# EAGLE schematic omnetics-adapter-64 (EAGLE 8.3.2)
DESIGNER: Jonathan Newman; DESIGN_NAME: 64 Channel Hirose to Omnetics Adapter; LICENSE: See README; REVISION: B
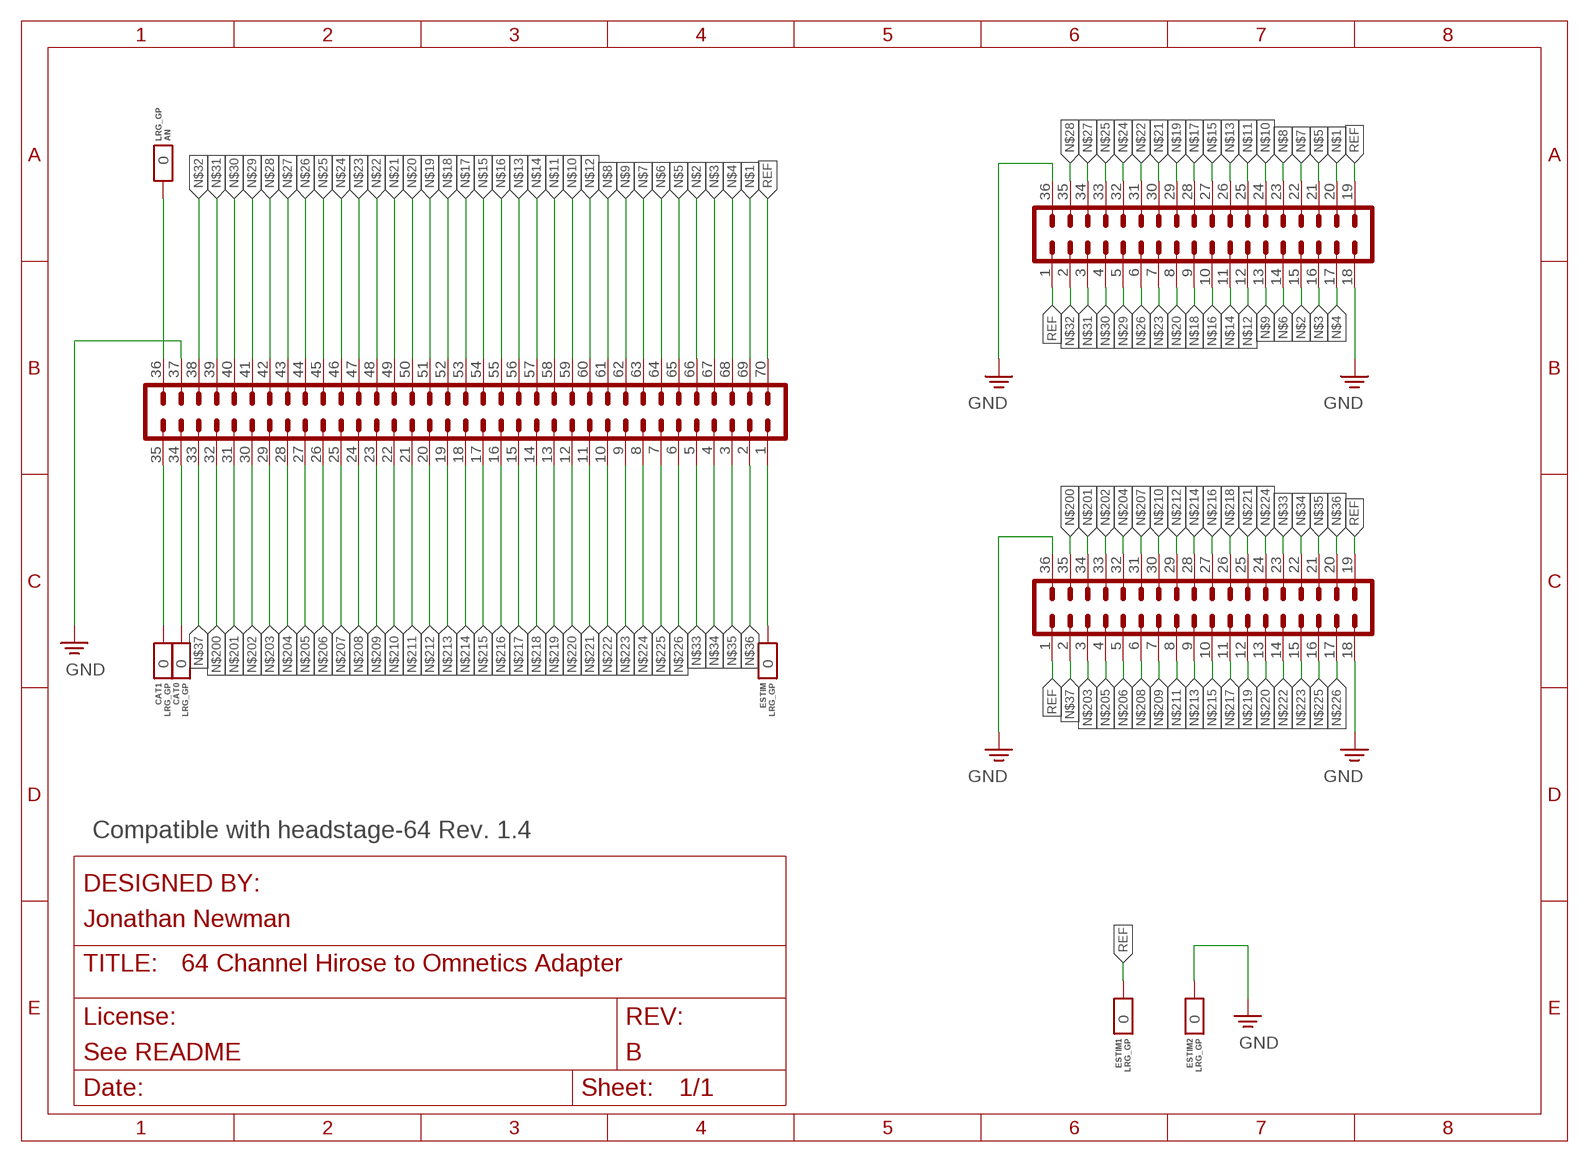
[diagram p0: schematic, sheet 1]

## Parts
AN  LRG_GP  GOLDPIN_0.5ID_0.7OD  [GOLDPIN_0.5ID_0.7OD]
CAT0  LRG_GP  GOLDPIN_0.5ID_0.7OD  [GOLDPIN_0.5ID_0.7OD]
CAT1  LRG_GP  GOLDPIN_0.5ID_0.7OD  [GOLDPIN_0.5ID_0.7OD]
ESTIM  LRG_GP  GOLDPIN_0.5ID_0.7OD  [GOLDPIN_0.5ID_0.7OD]
ESTIM1  LRG_GP  GOLDPIN_0.5ID_0.7OD  [GOLDPIN_0.5ID_0.7OD]
ESTIM2  LRG_GP  GOLDPIN_0.5ID_0.7OD  [GOLDPIN_0.5ID_0.7OD]
J1  DF40-REC  PINHD-2X35_DF40REF-LRG  [DDF40-70REC-LRG]
J2  PINHD-2X18_NPD  [NPD-36-VV-GS]
J3  PINHD-2X18_NPD  [NPD-36-VV-GS]

## Nets
AN: AN.P$1 J1.36
CAT0: CAT0.P$1 J1.34
CAT1: CAT1.P$1 J1.35
ESTIM: ESTIM.P$1 J1.1
GND: ESTIM2.P$1 J1.37 J2.18 J2.36 J3.18 J3.36
N$1: J1.69 J2.20
N$2: J1.66 J2.15
N$3: J1.67 J2.16
N$4: J1.68 J2.17
N$5: J1.65 J2.21
N$6: J1.64 J2.14
N$7: J1.63 J2.22
N$8: J1.61 J2.23
N$9: J1.62 J2.13
N$10: J1.59 J2.24
N$11: J1.58 J2.25
N$12: J1.60 J2.12
N$13: J1.56 J2.26
N$14: J1.57 J2.11
N$15: J1.54 J2.27
N$16: J1.55 J2.10
N$17: J1.53 J2.28
N$18: J1.52 J2.9
N$19: J1.51 J2.29
N$20: J1.50 J2.8
N$21: J1.49 J2.30
N$22: J1.48 J2.31
N$23: J1.47 J2.7
N$24: J1.46 J2.32
N$25: J1.45 J2.33
N$26: J1.44 J2.6
N$27: J1.43 J2.34
N$28: J1.42 J2.35
N$29: J1.41 J2.5
N$30: J1.40 J2.4
N$31: J1.39 J2.3
N$32: J1.38 J2.2
N$33: J1.5 J3.23
N$34: J1.4 J3.22
N$35: J1.3 J3.21
N$36: J1.2 J3.20
N$37: J1.33 J3.2
N$200: J1.32 J3.35
N$201: J1.31 J3.34
N$202: J1.30 J3.33
N$203: J1.29 J3.3
N$204: J1.28 J3.32
N$205: J1.27 J3.4
N$206: J1.26 J3.5
N$207: J1.25 J3.31
N$208: J1.24 J3.6
N$209: J1.23 J3.7
N$210: J1.22 J3.30
N$211: J1.21 J3.8
N$212: J1.20 J3.29
N$213: J1.19 J3.9
N$214: J1.18 J3.28
N$215: J1.17 J3.10
N$216: J1.16 J3.27
N$217: J1.15 J3.11
N$218: J1.14 J3.26
N$219: J1.13 J3.12
N$220: J1.12 J3.13
N$221: J1.11 J3.25
N$222: J1.10 J3.14
N$223: J1.9 J3.15
N$224: J1.8 J3.24
N$225: J1.7 J3.16
N$226: J1.6 J3.17
REF: ESTIM1.P$1 J1.70 J2.1 J2.19 J3.1 J3.19

## Notes on the sheet
- Compatible with headstage-64 Rev. 1.4

## Library data of the parts
AN CAT0 CAT1 ESTIM ESTIM1 ESTIM2 = jonnew:GOLDPIN
J1 = jonnew:PINHD-2X35
J2 J3 = jonnew:PINHD-2X18: Omnetics 36-pin connector, vertical surface-mount